# EAGLE design untitled (EAGLE 6.1)
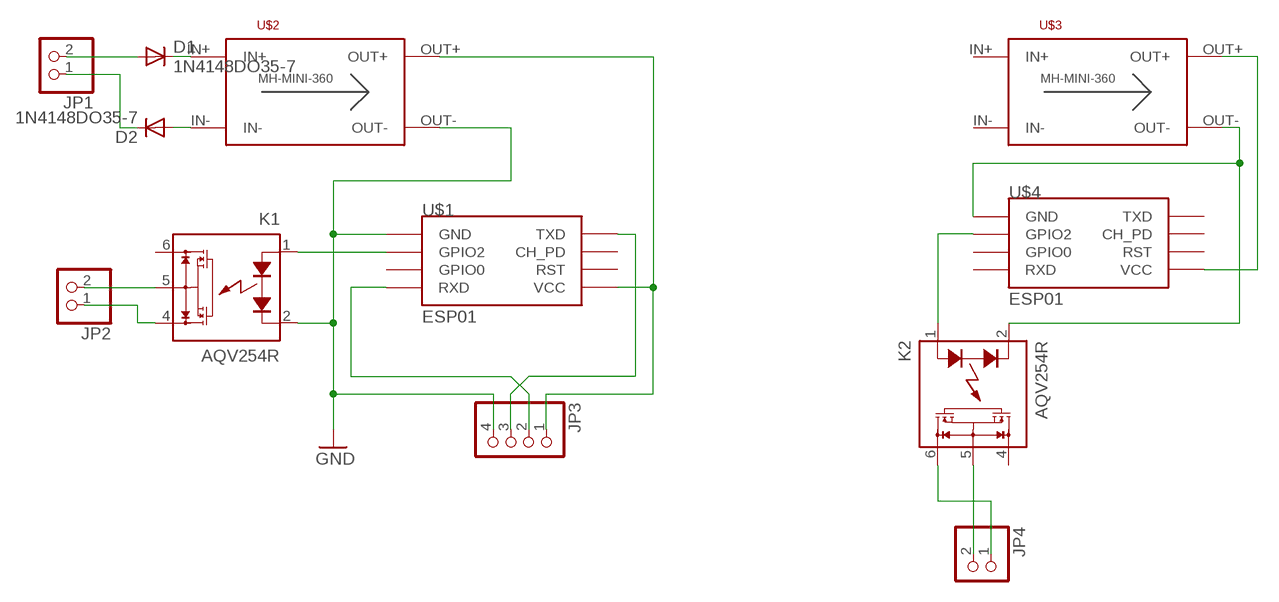
[diagram p0: schematic, sheet 1]

## Parts
D1  1N4148DO35-7  [DO35-7]
D2  1N4148DO35-7  [DO35-7]
JP1  PINHD-1X2  [1X02]
JP2  PINHD-1X2  [1X02]
JP3  PINHD-1X4  [1X04]
JP4  PINHD-1X2  [1X02]
K1  AQV254R  [DIL06]
K2  AQV254R  [DIL06]
U$1  ESP01  [ESP01]
U$2  DC-DC_CONV_MINISTD  [DC-DC_CONV_MINI]
U$3  DC-DC_CONV_MINISTD  [DC-DC_CONV_MINI]
U$4  ESP01  [ESP01]

## Nets
GND: JP3.4 K1.2(K) U$1.GND U$2.OUT-
N$1: D1.C U$2.IN+
N$2: D2.A U$2.IN-
N$3: JP2.2 K1.5(S)
N$4: JP3.1 U$1.VCC U$2.OUT+
N$5: K1.1(A) U$1.GPIO2
N$6: JP3.2 U$1.RX(RXD)
N$7: JP3.3 U$1.TX(TXD)
N$8: JP2.1 K1.4(D2)
N$9: D1.A JP1.2
N$10: D2.C JP1.1
N$11: K2.2(K) U$3.OUT- U$4.GND
N$12: U$3.OUT+ U$4.VCC
N$13: K2.1(A) U$4.GPIO2
N$14: JP4.2 K2.5(S)
N$15: JP4.1 K2.6(D1)
Unconnected: K1.6(D1) K2.4(D2) U$1.CH_PD U$1.GPIO0 U$1.RST U$3.IN+ U$3.IN- U$4.CH_PD U$4.GPIO0 U$4.RST U$4.RX(RXD) U$4.TX(TXD)

## Library data of the parts
D1 D2 = diode:1N4148: DIODE high speed (Philips)
JP1 JP2 JP4 = pinhead:PINHD-1X2: PIN HEADER
JP3 = pinhead:PINHD-1X4: PIN HEADER
K1 K2 = relay:AQV254R: PhotoMOS Relay NAiS Source: http://www.mew-europe.com/.. pti_en.pdf; MF: AROMAT/ MATSUSHITA; MPN: AQV254; OC_FARNELL: 1124063; OC_NEWARK: 93F6300
U$1 U$4 = esp8266modules:ESP01: ESP8266 Wifi module 01
U$2 U$3 = _MY_OWN_LIB:DC-DC_CONV_MINI

## Board
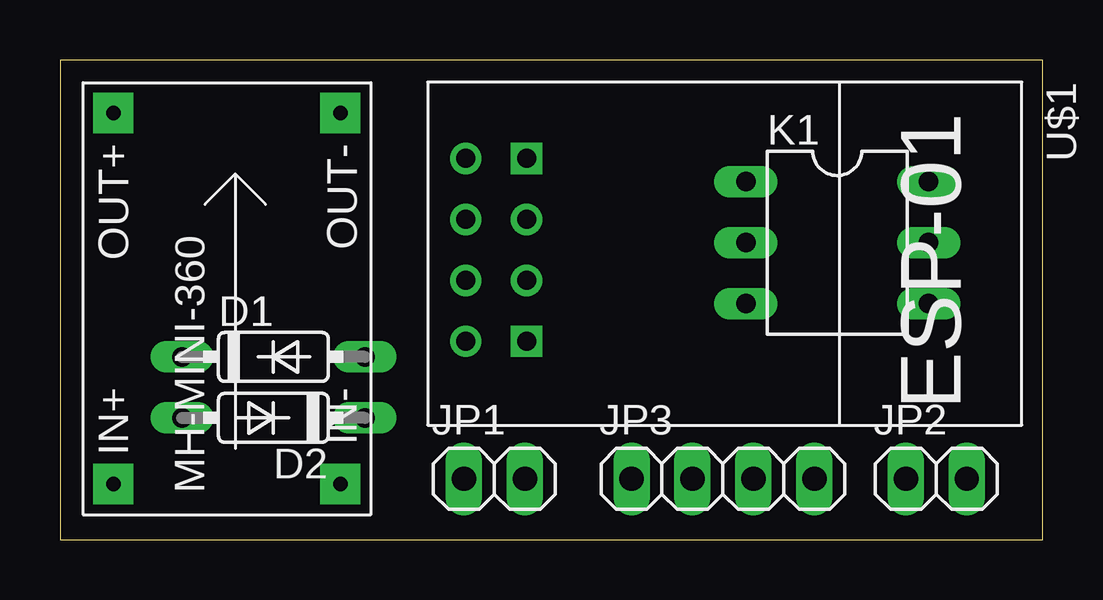
[diagram p1: board, top side]
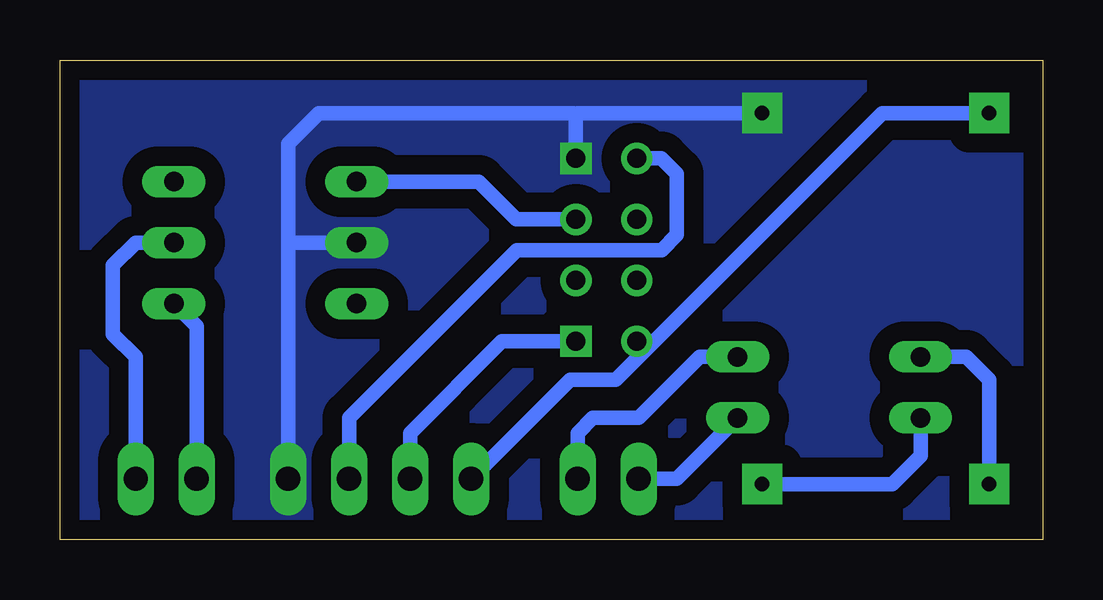
[diagram p2: board, bottom side, seen from below]

Size 40.94 x 19.99 mm. Coordinates in mm from the lower left corner, seen from the top.
Outline: 0,0 40.94,0 40.94,19.99 0,19.99 0,0
Copper layers (1*16): Top 0.035mm / dielectric 1.5mm / Bottom 0.035mm
Design rules: minimum track width 10mil, minimum drill 24mil, track to track 12mil, track to pad 12mil, pad to pad 12mil, via to via 12mil, smd to smd 10mil, copper to edge 12mil, drill to drill 12mil, minimum pad ring 10mil, minimum via ring 10mil, stop-mask expansion 4mil, vias tented up to drill 0mil, thermal gap 12mil

### Footprints (pad centres in the part's own frame; a part is rotated, then mirrored left to right if it is on the bottom)
DO35-7 = drill 0.813 long: A 3.81,0; C -3.81,0
1X02 = drill 1.016 long: 1 -1.27,0; 2 1.27,0
1X04 = drill 1.016 long: 1 -3.81,0; 2 -1.27,0; 3 1.27,0; 4 3.81,0
DIL06 = drill 0.813 long: 1 -2.54,-3.81; 2 0,-3.81; 3 2.54,-3.81; 4 2.54,3.81; 5 0,3.81; 6 -2.54,3.81
ESP01 = drill 0.8: CH_PD -1.285,-8.178; GPIO0 1.255,-5.638; GPIO2 -1.285,-5.638; RST 1.255,-8.178; TX -3.825,-8.178; VCC 3.795,-8.178 | drill 0.8 square: GND -3.825,-5.638; RX 3.795,-5.638
DC-DC_CONV_MINI = drill 0.6 pad 1.676 square: IN+ 16.73,1.27; IN- 16.73,10.73; OUT+ 1.27,1.27; OUT- 1.27,10.73

### Placement (x,y rotation side)
D1  8.89,7.62 0 top
D2  8.89,5.08 180 top
JP1  18.1,2.54 0 top
JP2  36.51,2.54 0 top
JP3  27.62,2.54 0 top
JP4  80.96,-6.67 180 top  (outside the outline)
K1  32.38,12.38 270 top
K2  79.69,3.49 180 top  (outside the outline)
U$1  25.08,12.06 270 top
U$2  0.95,19.05 270 top
U$3  57.47,13.02 270 top  (outside the outline)
U$4  80.96,5.71 180 top  (outside the outline)

### Tracks (layer width: path | path; a pad name or v marks a point on that pad's centre or on a via)
GND
  Bottom 0.61: U$2.OUT- 19.37,17.78 19.45,17.7 | U$1.GND 19.45,17.7 | JP3.4 31.43,12.38 | 31.43,12.38 31.43,16.51 30.16,17.78 19.52,17.78 19.45,17.7 | K1.2 31.43,12.38
  pour Bottom (isolate 0.813, no thermals): 0,0 40.96,0 40.96,20 0,20
N$1
  Bottom 0.61: U$2.IN+ 2.22,6.67 3.17,7.62 D1.C
N$2
  Bottom 0.61: U$2.IN- 6.25,2.32 5.08,3.49 D2.A
N$3
  Bottom 0.61: K1.5 37.78,12.38 38.73,11.43 38.73,8.57 37.78,7.62 JP2.2
N$4
  Bottom 0.61: JP3.1 19.68,6.67 17.78,6.67 16.51,7.94 | 16.51,7.94 6.67,17.78 U$2.OUT+ | U$1.VCC 16.84,8.27 16.51,7.94
N$5
  Bottom 0.61: U$1.GPIO2 21.92,13.35 23.5,14.92 K1.1
N$6
  Bottom 0.61: U$1.RX 22.53,8.27 26.35,4.45 JP3.2
N$7
  Bottom 0.61: U$1.TX 15.89,15.89 15.24,15.24 15.24,12.7 15.88,12.06 21.91,12.06 28.89,5.08 JP3.3
N$8
  Bottom 0.61: JP2.1 35.24,8.89 K1.4
N$9
  Bottom 0.61: D1.A 14.29,7.62 16.83,5.08 18.73,5.08 19.37,4.45 JP1.2
N$10
  Bottom 0.61: D2.C 15.24,2.54 JP1.1
N$11  (2 unrouted)
N$12  (1 unrouted)
N$13  (1 unrouted)
N$14  (1 unrouted)
N$15  (1 unrouted)